# EasyEDA schematic SCH_ESP32_AG_2025-02-10.json
TITLE: Sheet_1; REV: 1.0; Date: 2024-03-30; Sheet: 1/1; Drawn By: mrpoke21; Company: Your Company
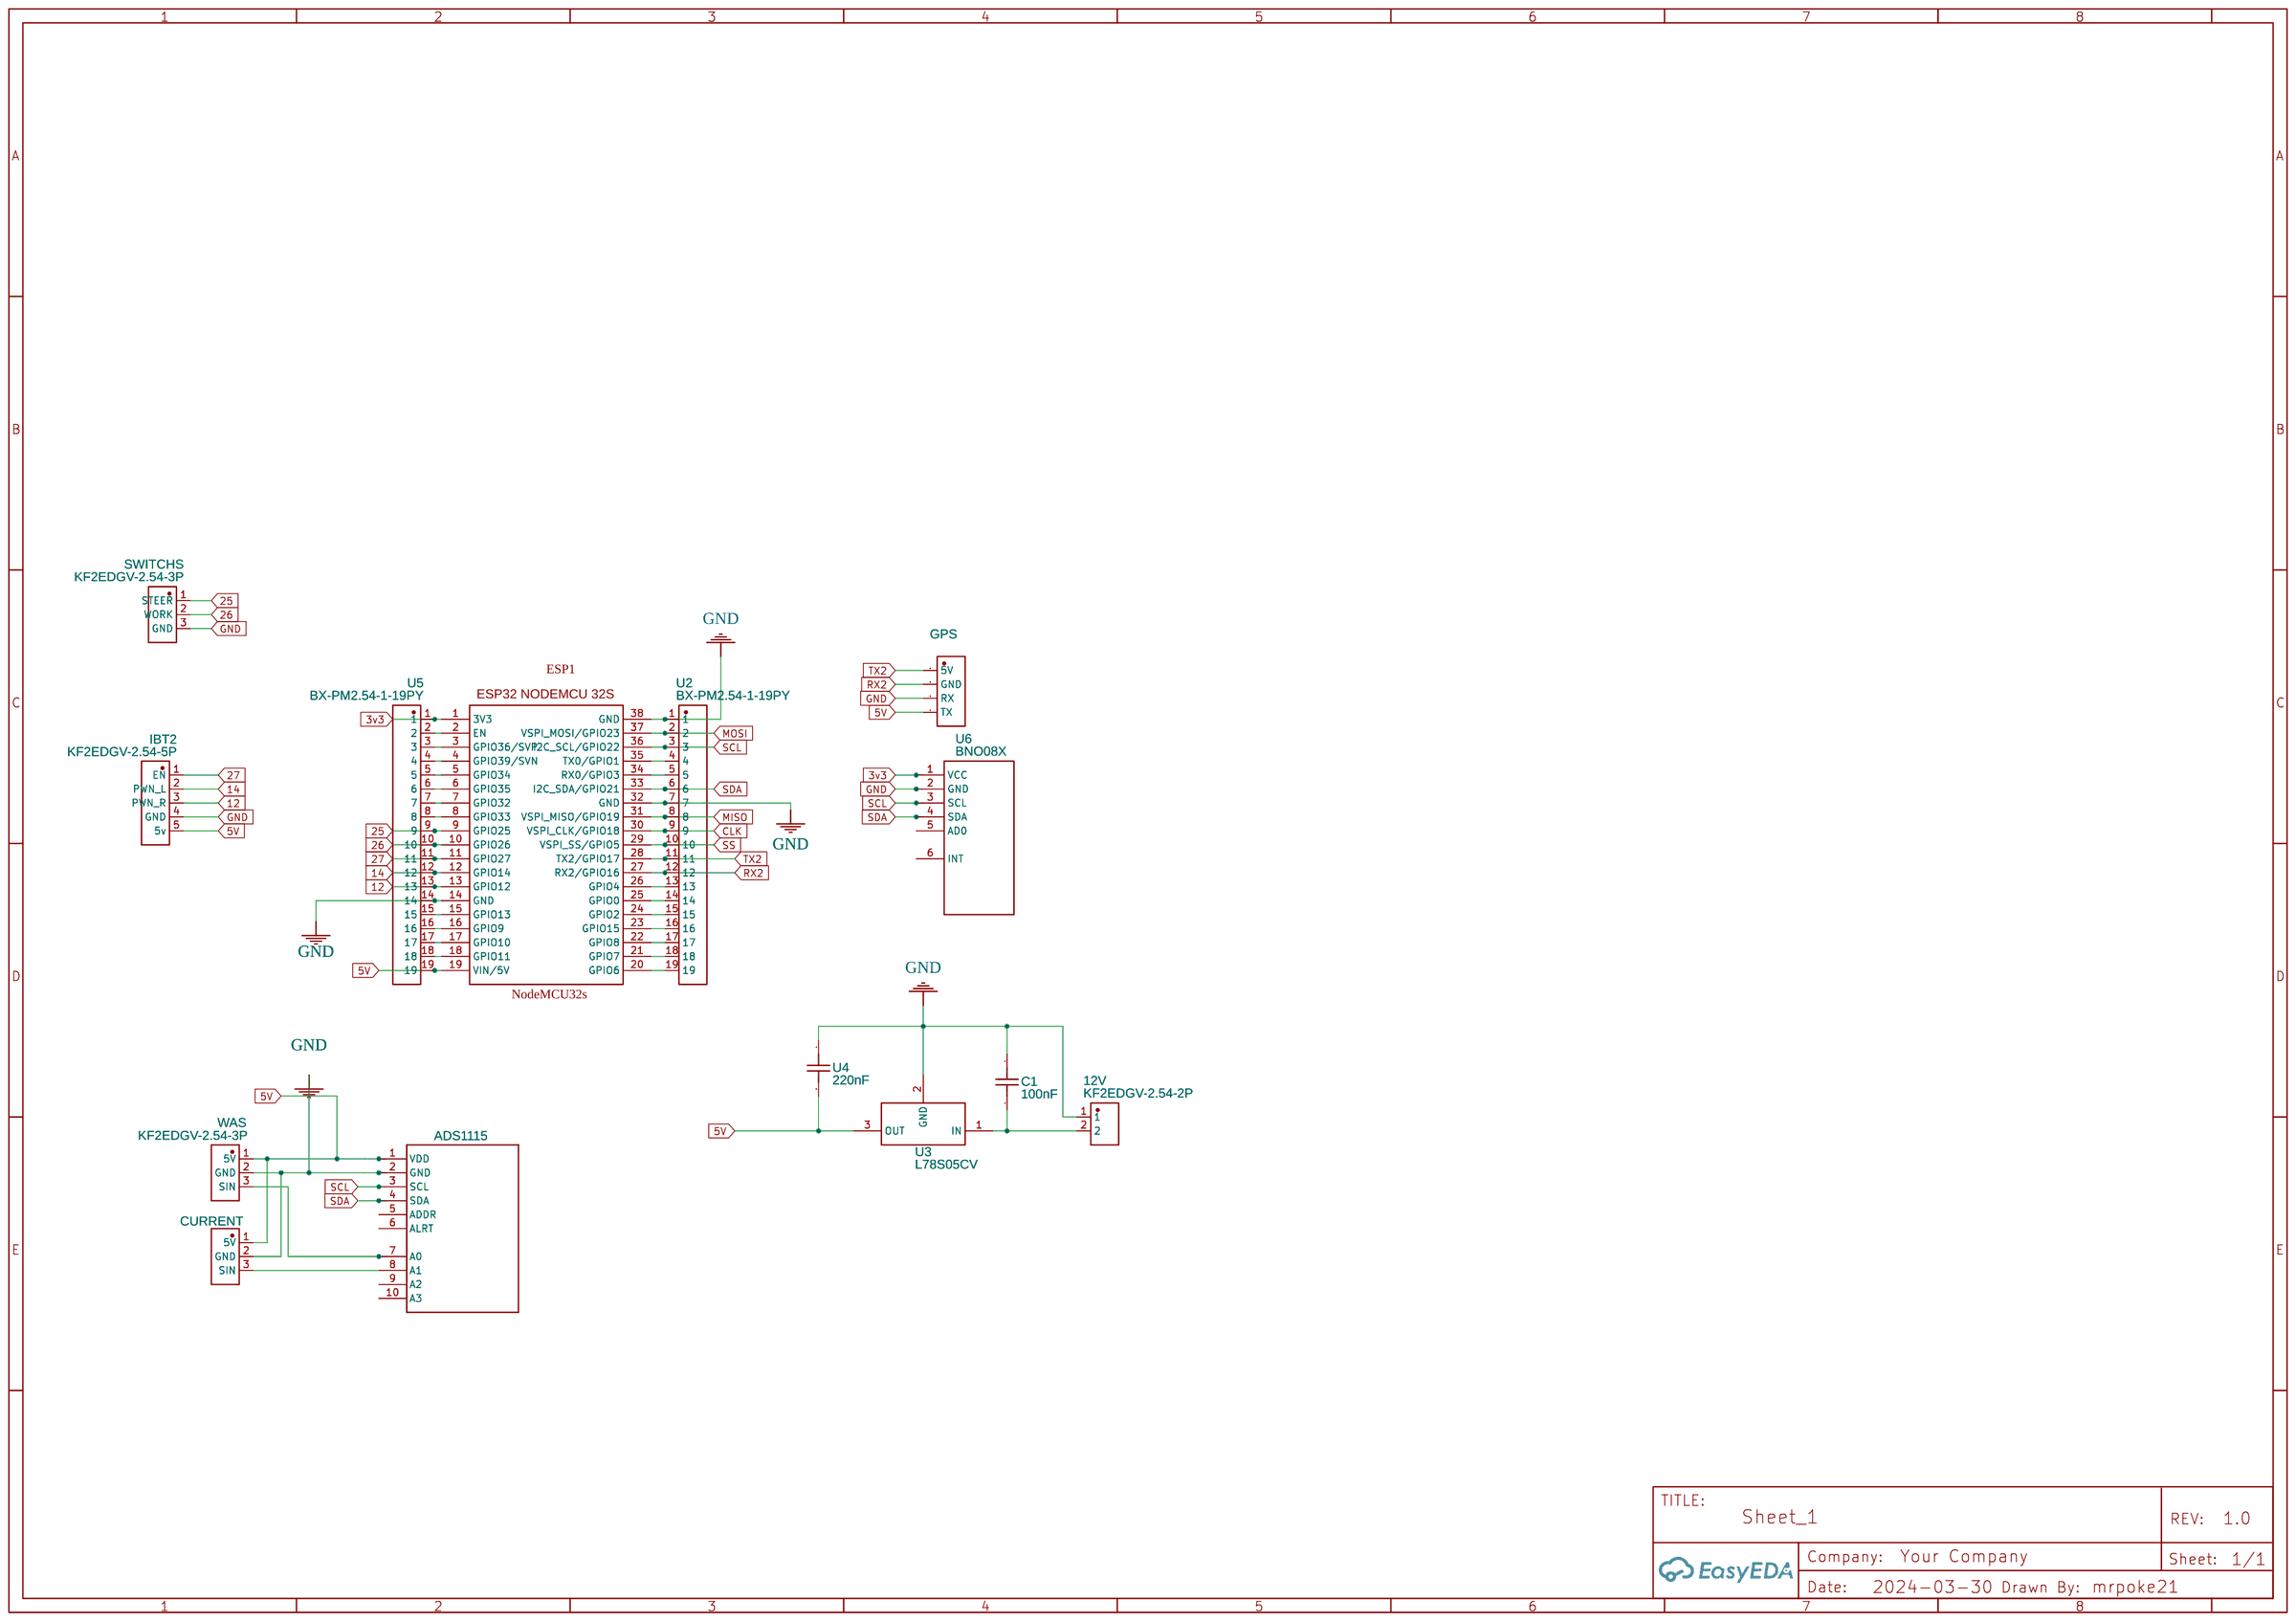
[diagram p0: schematic sheet]

## Parts
12V  KF2EDGV-2.54-2P  [CONN-TH_KF2EDGV-2.54-2P]
ADS1115  ADS1115  [ADC-4CH-ADS1115]
C1  100nF  [CAP-TH_L5.8-W2.4-P2.54-D0.6]
CURRENT  KF2EDGV-2.54-3P  [CONN-TH_3P-P2.54_KF2EDGV-2.54-3P]
GPS  KF2EDGV-2.54-4P  [CONN-TH_4P-P2.54_KF2EDGV-2.54-4P]
IBT2  KF2EDGV-2.54-5P  [CONN-TH_5P-P2.54_KF2EDGV-2.54-5P]
SWITCHS  KF2EDGV-2.54-3P  [CONN-TH_3P-P2.54_KF2EDGV-2.54-3P]
U1  NodeMCU ESP-32S  [NODEMCU ESP-32S]
U2  BX-PM2.54-1-19PY  [HDR-TH_19P-P2.54-V-F]
U3  L78S05CV  [TO-220-3_L10.0-W4.5-P2.54-L]
U4  220nF  [CAP-TH_L7.5-W3.2-P5.08-D0.6]
U5  BX-PM2.54-1-19PY  [HDR-TH_19P-P2.54-V-F]
U6  BNO08X  [BNO085 SLIMEVR MODULE_1]
WAS  KF2EDGV-2.54-3P  [CONN-TH_3P-P2.54_KF2EDGV-2.54-3P]

## Library data of the parts
12V = KF2EDGV-2.54-2P: Contributor: LCSC; Supplier: LCSC; Supplier Part: C577535; Manufacturer: KEFA(科发); JLCPCB Part Class: Extended Part
ADS1115 = ADC-4CH-ADS1115 SIL: Contributor: Azias
C1 = CC1H104ZA1ED3F5P1100: Contributor: LCSC; Supplier: LCSC; Supplier Part: C2832506; Manufacturer: Dersonic(德尔创); JLCPCB Part Class: Extended Part
CURRENT SWITCHS WAS = KF2EDGV-2.54-3P: Contributor: LCSC; Supplier: LCSC; Supplier Part: C577536; Manufacturer: KEFA(科发); JLCPCB Part Class: Extended Part
GPS = KF2EDGV-2.54-4P: Contributor: LCSC; Supplier: LCSC; Supplier Part: C577587; Manufacturer: KEFA(科发); JLCPCB Part Class: Extended Part; Package Display: No
IBT2 = KF2EDGV-2.54-5P: Contributor: LCSC; Supplier: LCSC; Supplier Part: C577588; Manufacturer: KEFA(科发); JLCPCB Part Class: Extended Part
U1 = NodeMCU ESP-32S: Contributor: mugenosekkai
U2 U5 = BX-PM2.54-1-19PY: Supplier: LCSC; Supplier Part: C18078138; Manufacturer: Bossie(博锡); Contributor: lcsc
U3 = L78S05CV: Supplier: LCSC; Manufacturer: ST(意法半导体); Supplier Part: C33043; JLCPCB Part Class: Extended Part
U4 = CC1H224ZC1GD3F8A3100: Supplier: LCSC; Supplier Part: C2761732; Manufacturer: Dersonic(德尔创); JLCPCB Part Class: Extended Part; Contributor: lcsc
U6 = BNO08X: Contributor: mrpoke21

## Nets
3v3: U1.1(3V3) U5.1 U6.1(VCC)
5V: ADS1115.1(VDD) CURRENT.1(5V) GPS.4(TX) IBT2.5(5v) U1.19(VIN/5V) U3.3(OUT) U4.2 U5.19 WAS.1(5V)
GND: 12V.1 ADS1115.2(GND) C1.1 CURRENT.2(GND) GPS.3(RX) IBT2.4(GND) SWITCHS.3(GND) U1.14(GND) U1.32(GND) U1.38(GND) U2.1 U2.7 U3.2(GND) U4.1 U5.14 U6.2(GND) WAS.2(GND)
12: IBT2.3(PWN_R) U1.13(GPIO12) U5.13
14: IBT2.2(PWN_L) U1.12(GPIO14) U5.12
25: SWITCHS.1(STEER) U1.9(GPIO25) U5.9
26: SWITCHS.2(WORK) U1.10(GPIO26) U5.10
27: IBT2.1(EN) U1.11(GPIO27) U5.11
CLK: U1.30(VSPI CLK/GPIO18) U2.9
MISO: U1.31(VSPI MISO/GPIO19) U2.8
MOSI: U1.37(VSPI MOSI/GPIO23) U2.2
RX2: GPS.2(GND) U1.27(RX2/GPIO16) U2.12
SCL: ADS1115.3(SCL) U1.36(I2C SCL/GPIO22) U2.3 U6.3(SCL)
SDA: ADS1115.4(SDA) U1.33(I2C SDA/GPIO21) U2.6 U6.4(SDA)
SS: U1.29(VSPI SS/GPIO5) U2.10
TX2: GPS.1(5V) U1.28(TX2/GPIO17) U2.11
Net-(12V-2): 12V.2 C1.2 U3.1(IN)
Net-(ADS1115-7): ADS1115.7(A0) WAS.3(SIN)
Net-(ADS1115-8): ADS1115.8(A1) CURRENT.3(SIN)
Net-(U1-2): U1.2(EN) U5.2
Net-(U1-3): U1.3(GPIO36/SVP) U5.3
Net-(U1-4): U1.4(GPIO39/SVN) U5.4
Net-(U1-5): U1.5(GPIO34) U5.5
Net-(U1-6): U1.6(GPIO35) U5.6
Net-(U1-7): U1.7(GPIO32) U5.7
Net-(U1-8): U1.8(GPIO33) U5.8
Net-(U1-15): U1.15(GPIO13) U5.15
Net-(U1-16): U1.16(GPIO9) U5.16
Net-(U1-17): U1.17(GPIO10) U5.17
Net-(U1-18): U1.18(GPIO11) U5.18
Net-(U1-20): U1.20(GPIO6) U2.19
Net-(U1-21): U1.21(GPIO7) U2.18
Net-(U1-22): U1.22(GPIO8) U2.17
Net-(U1-23): U1.23(GPIO15) U2.16
Net-(U1-24): U1.24(GPIO2) U2.15
Net-(U1-25): U1.25(GPIO0) U2.14
Net-(U1-26): U1.26(GPIO4) U2.13
Net-(U1-34): U1.34(RX0/GPIO3) U2.5
Net-(U1-35): U1.35(TX0/GPIO1) U2.4

Not connected (* = marked no-connect by the designer): ADS1115 5(ADDR) 6(ALRT) 9(A2) 10(A3); U6 5(AD0) 6(INT)
